# Altium project VYLTIOT0OSM-SF.PrjPcb
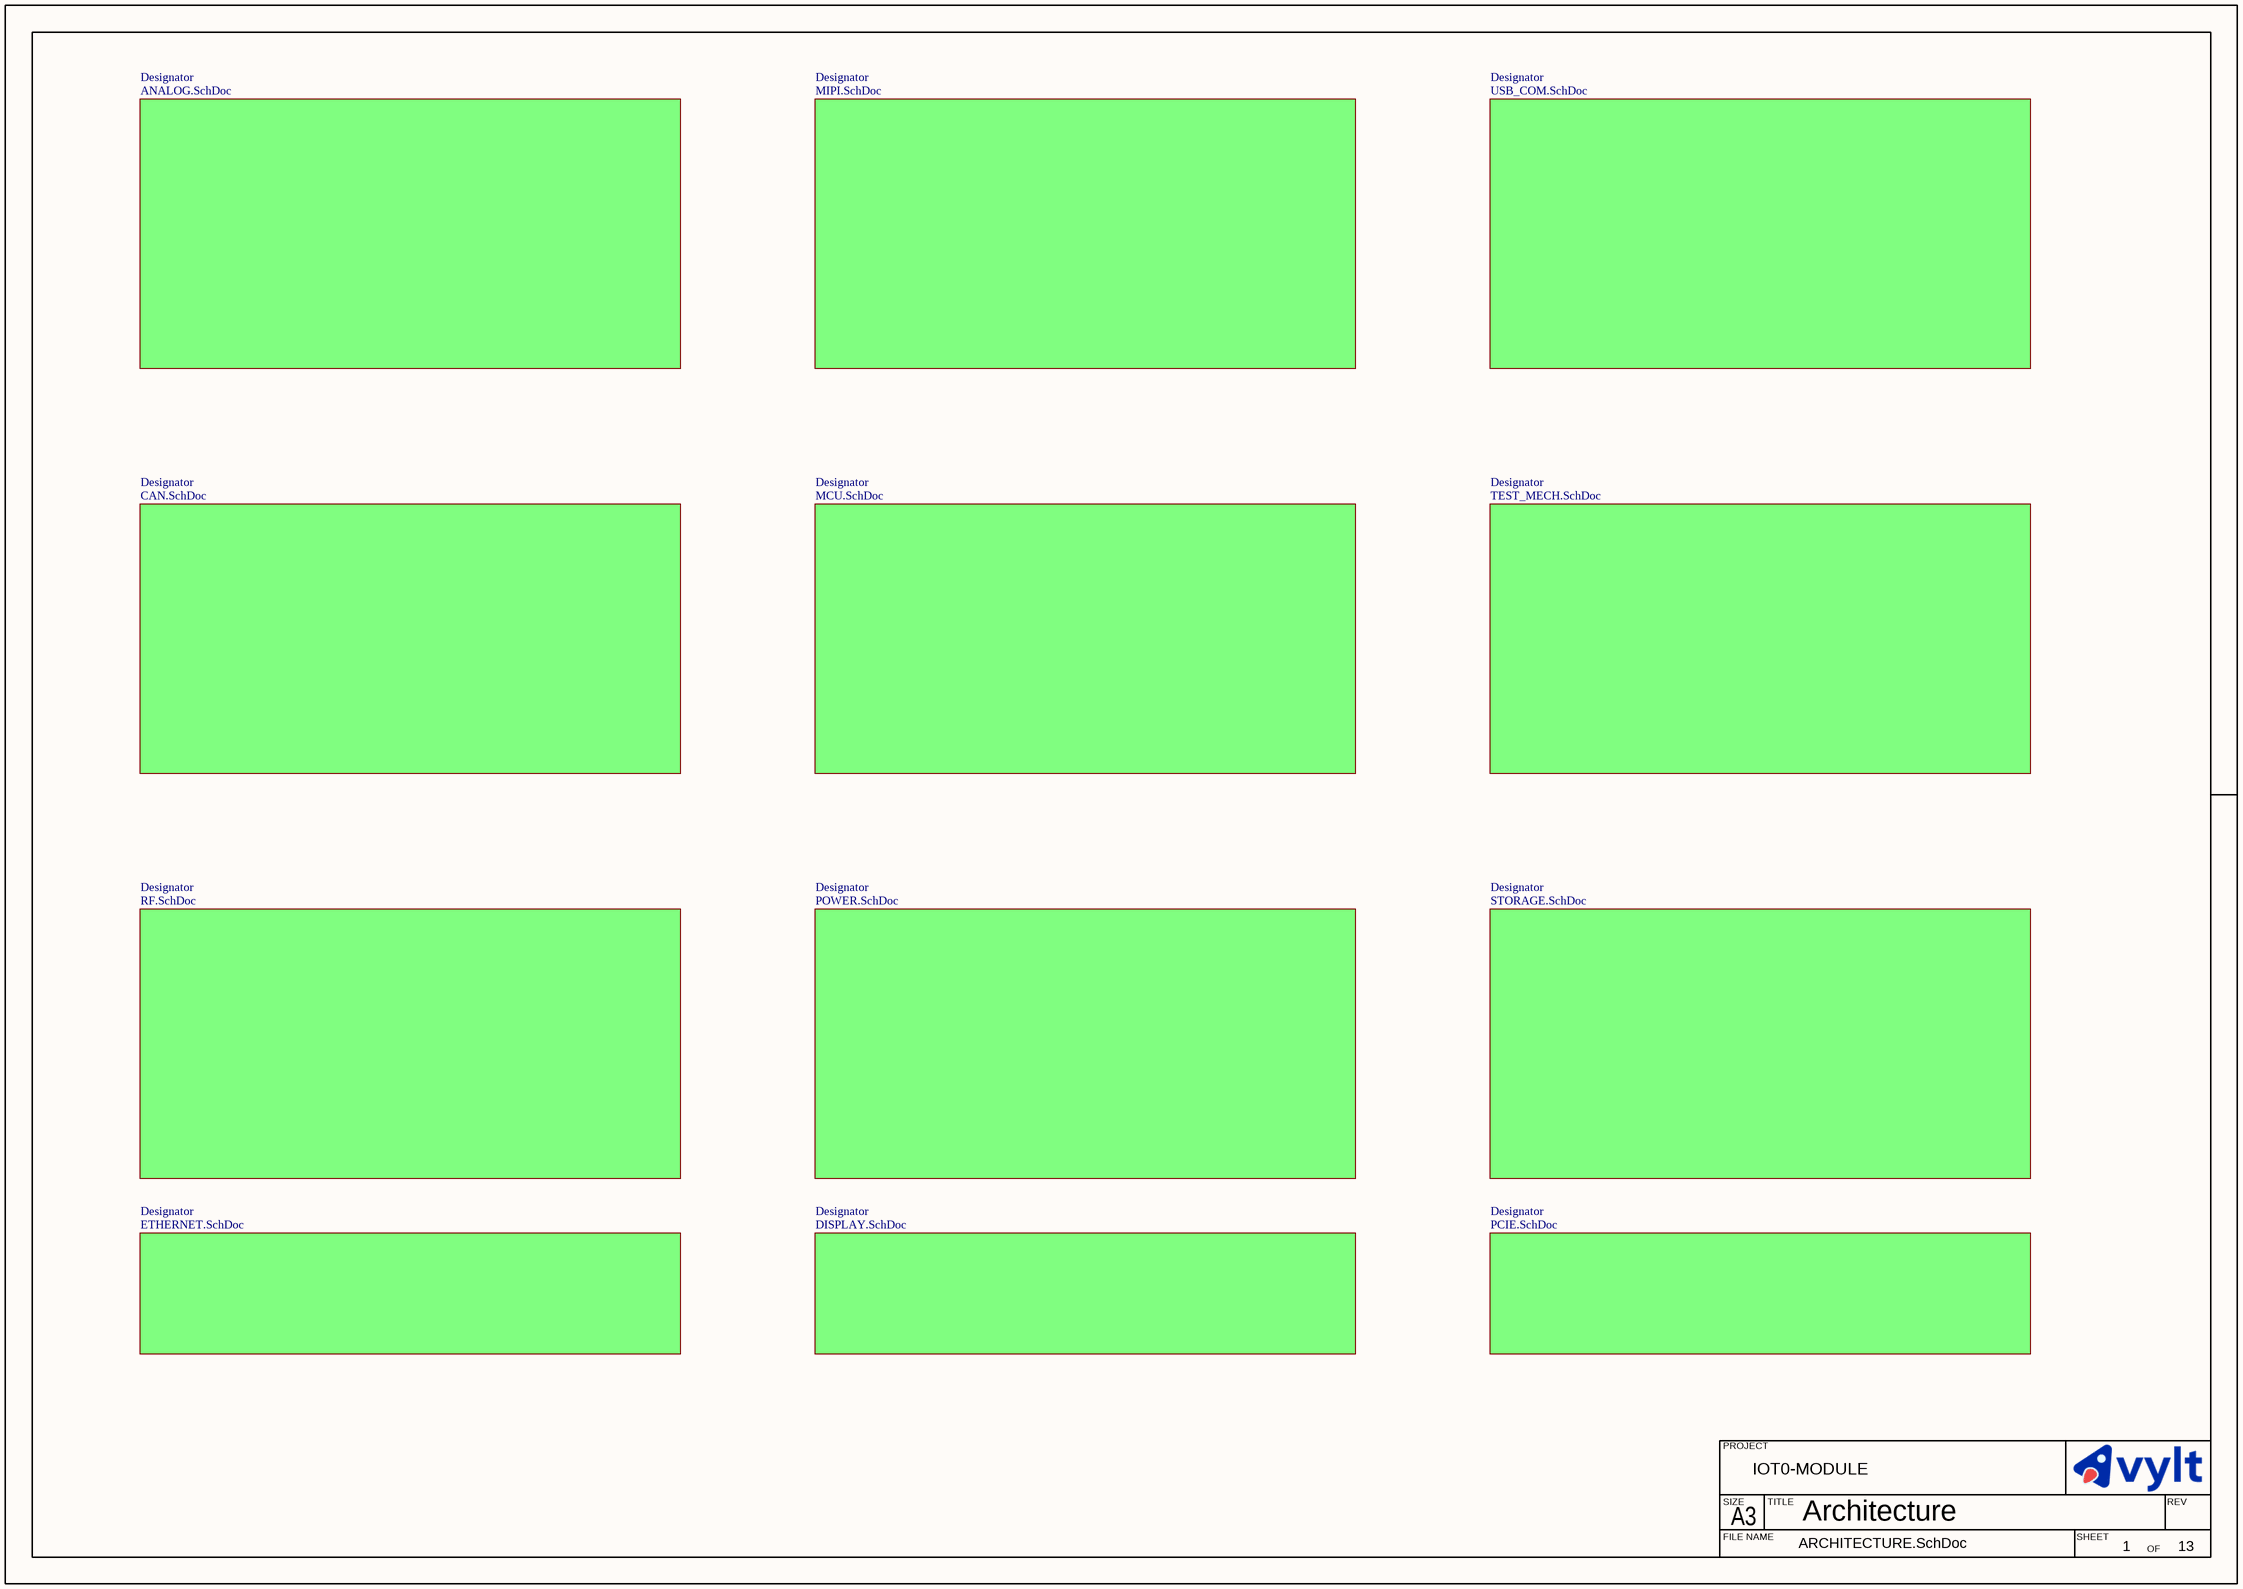
[diagram p0: ARCHITECTURE.SchDoc]
SheetTotal: 13; Rev: 1.0; Project: IOT0-MODULE
9 sheets, 360 parts. Net scope: global (net labels, ports and power ports of the same name join across sheets).
Board file: VYLTIOT0OSM-SF.PcbDoc
Sheets:
  ARCHITECTURE.SchDoc
    Designator = MCU.SchDoc
    Designator = TEST_MECH.SchDoc
    Designator = RF.SchDoc
    Designator = POWER.SchDoc
    Designator = MIPI.SchDoc
    Designator = ETHERNET.SchDoc
    Designator = DISPLAY.SchDoc
    Designator = PCIE.SchDoc

## Sheet ARCHITECTURE.SchDoc: Architecture
size 420 x 297 mm; Revision: 1.0; SheetNumber: 1

### Sub-sheets
Designator = MCU.SchDoc: no entries
Designator = USB_COM.SchDoc (file not in this document): no entries
Designator = TEST_MECH.SchDoc: no entries
Designator = STORAGE.SchDoc (file not in this document): no entries
Designator = ANALOG.SchDoc (file not in this document): no entries
Designator = CAN.SchDoc (file not in this document): no entries
Designator = RF.SchDoc: no entries
Designator = POWER.SchDoc: no entries
Designator = MIPI.SchDoc: no entries
Designator = ETHERNET.SchDoc: no entries
Designator = DISPLAY.SchDoc: no entries
Designator = PCIE.SchDoc: no entries

### Notes on the sheet
- PROJECT
- SIZE
- FILE NAME
- A3
- TITLE
- SHEET
- OF
- REV

## Sheet MCU.SchDoc: ESP32 SoC
size 420 x 297 mm; Revision: 1.0; SheetNumber: 9
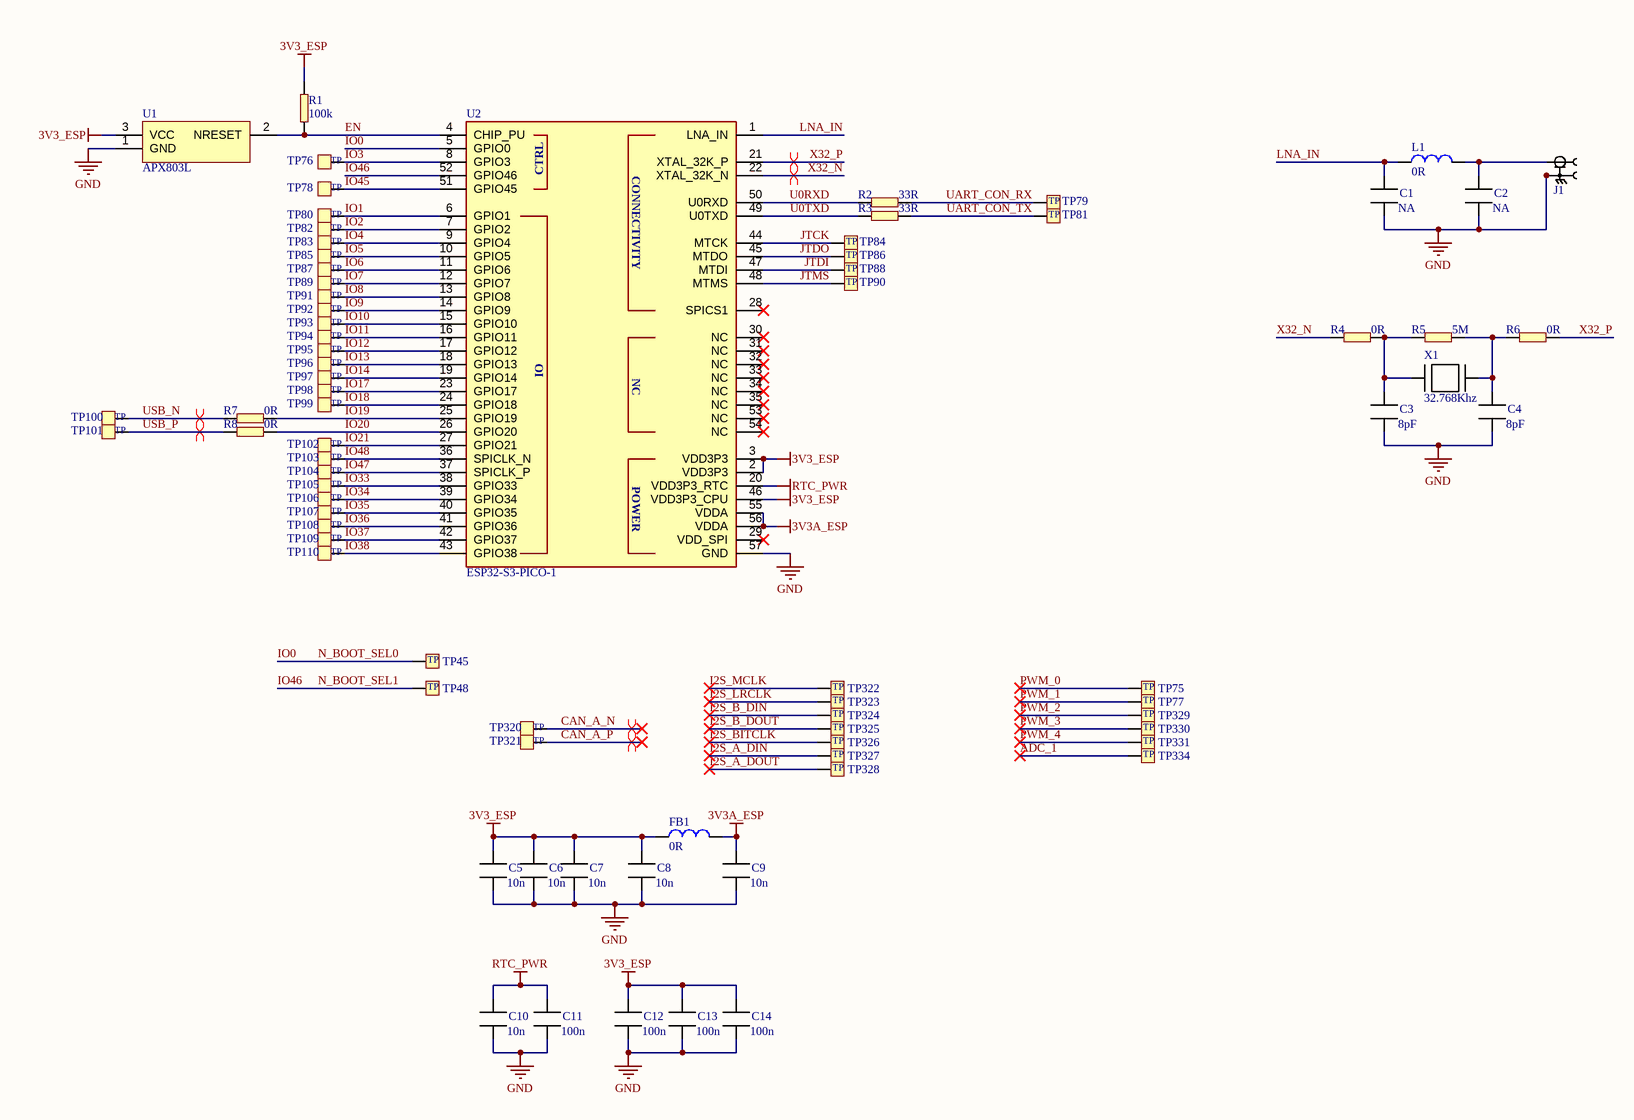
[diagram p1: MCU.SchDoc]

### Parts
C1  value NA  [CAPC0603X03L]  (hidden comment: ERP_102-1)  (no BOM)
C2  value NA  [CAPC0603X03L]  (hidden comment: ERP_102-1)  (no BOM)
C3  value 8pF  [CAPC0603X03L]  (hidden comment: ERP_102-1)  (no BOM)
C4  value 8pF  [CAPC0603X03L]  (hidden comment: ERP_102-1)  (no BOM)
C5  value 10n  [CAPC0603X03L]  (hidden comment: ERP_102-1)
C6  value 10n  [CAPC0603X03L]  (hidden comment: ERP_102-1)
C7  value 10n  [CAPC0603X03L]  (hidden comment: ERP_102-1)
C8  value 10n  [CAPC0603X03L]  (hidden comment: ERP_102-1)
C9  value 10n  [CAPC0603X03L]  (hidden comment: ERP_102-1)
C10  value 10n  [CAPC0603X03L]  (hidden comment: ERP_102-1)
C11  value 100n  [CAPC0603X03L]  (hidden comment: ERP_102-1)
C12  value 100n  [CAPC0603X03L]  (hidden comment: ERP_102-1)
C13  value 100n  [CAPC0603X03L]  (hidden comment: ERP_102-1)
C14  value 100n  [CAPC0603X03L]  (hidden comment: ERP_102-1)
FB1  value 0R  [INDC0603X03L]  (hidden comment: ERP_103-3)
J1  ERP_148-1  [uFL_50R]  (value not drawn)
L1  value 0R  [IND_0603]  (hidden comment: ERP_103-3)
R1  value 100k  [RESC0603X03L]  (hidden comment: ERP_101-1)
R2  value 33R  [RESC0603X03L]  (hidden comment: ERP_101-1)
R3  value 33R  [RESC0603X03L]  (hidden comment: ERP_101-1)
R4  value 0R  [RESC0603X03L]  (hidden comment: ERP_101-1)
R5  value 5M  [RESC0603X03L]  (hidden comment: ERP_101-1)  (no BOM)
R6  value 0R  [RESC0603X03L]  (hidden comment: ERP_101-1)
R7  value 0R  [RESC0603X03L]  (hidden comment: ERP_101-1)
R8  value 0R  [RESC0603X03L]  (hidden comment: ERP_101-1)
TP45  TP_0P8MM  [TP_0P8MM]  (value not drawn)  (no BOM)
TP48  TP_0P8MM  [TP_0P8MM]  (value not drawn)  (no BOM)
TP75  TP_0P8MM  [TP_0P8MM]  (value not drawn)  (no BOM)
TP76  TP_0P8MM  [TP_0P8MM]  (value not drawn)  (no BOM)
TP77  TP_0P8MM  [TP_0P8MM]  (value not drawn)  (no BOM)
TP78  TP_0P8MM  [TP_0P8MM]  (value not drawn)  (no BOM)
TP79  TP_0P8MM  [TP_0P8MM]  (value not drawn)  (no BOM)
TP80  TP_0P8MM  [TP_0P8MM]  (value not drawn)  (no BOM)
TP81  TP_0P8MM  [TP_0P8MM]  (value not drawn)  (no BOM)
TP82  TP_0P8MM  [TP_0P8MM]  (value not drawn)  (no BOM)
TP83  TP_0P8MM  [TP_0P8MM]  (value not drawn)  (no BOM)
TP84  TP_0P8MM  [TP_0P8MM]  (value not drawn)  (no BOM)
TP85  TP_0P8MM  [TP_0P8MM]  (value not drawn)  (no BOM)
TP86  TP_0P8MM  [TP_0P8MM]  (value not drawn)  (no BOM)
TP87  TP_0P8MM  [TP_0P8MM]  (value not drawn)  (no BOM)
TP88  TP_0P8MM  [TP_0P8MM]  (value not drawn)  (no BOM)
TP89  TP_0P8MM  [TP_0P8MM]  (value not drawn)  (no BOM)
TP90  TP_0P8MM  [TP_0P8MM]  (value not drawn)  (no BOM)
TP91  TP_0P8MM  [TP_0P8MM]  (value not drawn)  (no BOM)
TP92  TP_0P8MM  [TP_0P8MM]  (value not drawn)  (no BOM)
TP93  TP_0P8MM  [TP_0P8MM]  (value not drawn)  (no BOM)
TP94  TP_0P8MM  [TP_0P8MM]  (value not drawn)  (no BOM)
TP95  TP_0P8MM  [TP_0P8MM]  (value not drawn)  (no BOM)
TP96  TP_0P8MM  [TP_0P8MM]  (value not drawn)  (no BOM)
TP97  TP_0P8MM  [TP_0P8MM]  (value not drawn)  (no BOM)
TP98  TP_0P8MM  [TP_0P8MM]  (value not drawn)  (no BOM)
TP99  TP_0P8MM  [TP_0P8MM]  (value not drawn)  (no BOM)
TP100  TP_0P8MM  [TP_0P8MM]  (value not drawn)  (no BOM)
TP101  TP_0P8MM  [TP_0P8MM]  (value not drawn)  (no BOM)
TP102  TP_0P8MM  [TP_0P8MM]  (value not drawn)  (no BOM)
TP103  TP_0P8MM  [TP_0P8MM]  (value not drawn)  (no BOM)
TP104  TP_0P8MM  [TP_0P8MM]  (value not drawn)  (no BOM)
TP105  TP_0P8MM  [TP_0P8MM]  (value not drawn)  (no BOM)
TP106  TP_0P8MM  [TP_0P8MM]  (value not drawn)  (no BOM)
TP107  TP_0P8MM  [TP_0P8MM]  (value not drawn)  (no BOM)
TP108  TP_0P8MM  [TP_0P8MM]  (value not drawn)  (no BOM)
TP109  TP_0P8MM  [TP_0P8MM]  (value not drawn)  (no BOM)
TP110  TP_0P8MM  [TP_0P8MM]  (value not drawn)  (no BOM)
TP320  TP_0P8MM  [TP_0P8MM]  (value not drawn)  (no BOM)
TP321  TP_0P8MM  [TP_0P8MM]  (value not drawn)  (no BOM)
TP322  TP_0P8MM  [TP_0P8MM]  (value not drawn)  (no BOM)
TP323  TP_0P8MM  [TP_0P8MM]  (value not drawn)  (no BOM)
TP324  TP_0P8MM  [TP_0P8MM]  (value not drawn)  (no BOM)
TP325  TP_0P8MM  [TP_0P8MM]  (value not drawn)  (no BOM)
TP326  TP_0P8MM  [TP_0P8MM]  (value not drawn)  (no BOM)
TP327  TP_0P8MM  [TP_0P8MM]  (value not drawn)  (no BOM)
TP328  TP_0P8MM  [TP_0P8MM]  (value not drawn)  (no BOM)
TP329  TP_0P8MM  [TP_0P8MM]  (value not drawn)  (no BOM)
TP330  TP_0P8MM  [TP_0P8MM]  (value not drawn)  (no BOM)
TP331  TP_0P8MM  [TP_0P8MM]  (value not drawn)  (no BOM)
TP334  TP_0P8MM  [TP_0P8MM]  (value not drawn)  (no BOM)
U1  APX803L  [APX803L]
U2  value ESP32-S3-PICO-1  [QFN40P700X700X106_HS-57N]  (hidden comment: ERP_121-4)
X1  value 32.768Khz  [CRYS_L1.6_W1]  (hidden comment: ERP_111-1)

### Nets
3V3_ESP: C5.1 C6.1 C7.1 C8.1 C12.1 C13.1 C14.1 FB1.1 R1.2 U1.3(VCC) U2.2(VDD3P3) U2.3(VDD3P3) U2.46(VDD3P3_CPU)
3V3A_ESP: C9.1 FB1.2 U2.55(VDDA) U2.56(VDDA)
GND: C1.2 C2.2 C3.2 C4.2 C5.2 C6.2 C7.2 C8.2 C9.2 C10.2 C11.2 C12.2 C13.2 C14.2 J1.2 J1.3 U1.1(GND) U2.57(GND)
RTC_PWR: C10.1 C11.1 U2.20(VDD3P3_RTC)
ADC_1: TP334.1
CAN_A_N: TP320.1
CAN_A_P: TP321.1
EN: R1.1 U1.2(NRESET) U2.4(CHIP_PU)
I2S_A_DIN: TP327.1
I2S_A_DOUT: TP328.1
I2S_B_DIN: TP324.1
I2S_B_DOUT: TP325.1
I2S_BITCLK: TP326.1
I2S_LRCLK: TP323.1
I2S_MCLK: TP322.1
IO0: TP45.1 U2.5(GPIO0)  [also labelled N_BOOT_SEL0]
IO1: TP80.1 U2.6(GPIO1)
IO2: TP82.1 U2.7(GPIO2)
IO3: TP76.1 U2.8(GPIO3)
IO4: TP83.1 U2.9(GPIO4)
IO5: TP85.1 U2.10(GPIO5)
IO6: TP87.1 U2.11(GPIO6)
IO7: TP89.1 U2.12(GPIO7)
IO8: TP91.1 U2.13(GPIO8)
IO9: TP92.1 U2.14(GPIO9)
IO10: TP93.1 U2.15(GPIO10)
IO11: TP94.1 U2.16(GPIO11)
IO12: TP95.1 U2.17(GPIO12)
IO13: TP96.1 U2.18(GPIO13)
IO14: TP97.1 U2.19(GPIO14)
IO17: TP98.1 U2.23(GPIO17)
IO18: TP99.1 U2.24(GPIO18)
IO19: R7.1 U2.25(GPIO19)
IO20: R8.1 U2.26(GPIO20)
IO21: TP102.1 U2.27(GPIO21)
IO33: TP105.1 U2.38(GPIO33)
IO34: TP106.1 U2.39(GPIO34)
IO35: TP107.1 U2.40(GPIO35)
IO36: TP108.1 U2.41(GPIO36)
IO37: TP109.1 U2.42(GPIO37)
IO38: TP110.1 U2.43(GPIO38)
IO45: TP78.1 U2.51(GPIO45)
IO46: TP48.1 U2.52(GPIO46)  [also labelled N_BOOT_SEL1]
IO47: TP104.1 U2.37(SPICLK_P)
IO48: TP103.1 U2.36(SPICLK_N)
JTCK: TP84.1 U2.44(MTCK)
JTDI: TP88.1 U2.47(MTDI)
JTDO: TP86.1 U2.45(MTDO)
JTMS: TP90.1 U2.48(MTMS)
LNA_IN: C1.1 L1.1 U2.1(LNA_IN)
PWM_0: TP75.1
PWM_1: TP77.1
PWM_2: TP329.1
PWM_3: TP330.1
PWM_4: TP331.1
U0RXD: R2.2 U2.50(U0RXD)
U0TXD: R3.2 U2.49(U0TXD)
UART_CON_RX: R2.1 TP79.1
UART_CON_TX: R3.1 TP81.1
USB_N: R7.2 TP100.1
USB_P: R8.2 TP101.1
X32_N: R4.2 U2.22(XTAL_32K_N)
X32_P: R6.1 U2.21(XTAL_32K_P)
NetC2_1: C2.1 J1.1 L1.2
NetC3_1: C3.1 R4.1 R5.2 X1.1
NetC4_1: C4.1 R5.1 R6.2 X1.2

Not connected (* = marked no-connect by the designer): U2 28(SPICS1)* 29(VDD_SPI)* 30(NC)* 31(NC)* 32(NC)* 33(NC)* 34(NC)* 35(NC)* 53(NC)* 54(NC)*

### Layout directives
differential pair: CAN_A_N, CAN_A_P, USB_N, USB_P, X32_N, X32_P

### Notes on the sheet
- PROJECT
- SIZE
- FILE NAME
- A3
- TITLE
- SHEET
- OF
- REV
- (in symbol ESP32-S3-PICO-1) CTRL; CONNECTIVITY; IO; POWER
- (in symbol TP_0P8MM) TP

### Library data of the parts
C1-C14 = MLCC_0201: Chip Capacitor, 2-Leads, Body 0.60x0.30mm, IPC High Density; Package: 0201; Manufacturer 1: *; Manufacturer Part Number 1: *; ERP: *
FB1 = FB_0201: FERRITE BEAD 0201; ERP: *; Manufacturer Part Number 1: *; Manufacturer 1: *; Package: 0201
J1 = uFL_50R: Package: UMCC; Value: *; ERP: *; Manufacturer 1: *; Manufacturer Part Number 1: *; Supplier 1: *; Suuplier Part Number 1: *
L1 = IND_0603: ERP: *; Suuplier Part Number 1: *; Supplier 1: *; Manufacturer Part Number 1: *; Manufacturer 1: *; Package: 0603
R1-R8 = RES_0201: Package: 0201; Manufacturer 1: *; Manufacturer Part Number 1: *; ERP: *
TP45 TP48 TP75-TP110 TP320-TP331 TP334 = TP_0P8MM: OSM Footprint 0P8 LGA Ball
U1 = APX803L: IC SUPERVISOR 1 CHANNEL SOT23; Manufacturer Part Number 1: APX803L20-33SA-7; Manufacturer 1: Diodes Incorporated; Value: APX803L
U2 = ESP32-S3-PICO-1: RF TXRX MOD BLUETOOTH WIFISMD; Manufacturer 1: Espressif Systems; Package: 56-TFQFN; ERP: *
X1 = CRYS_L1.6_W1: CRYSTAL 1P6XW1P0; Manufacturer Part Number 1: ECS-.327-6-16R-TR; Manufacturer 1: ECS Inc.; Package: 1P6_1P0; ERP: *

## Sheet TEST_MECH.SchDoc
size 420 x 297 mm; SheetNumber: 3
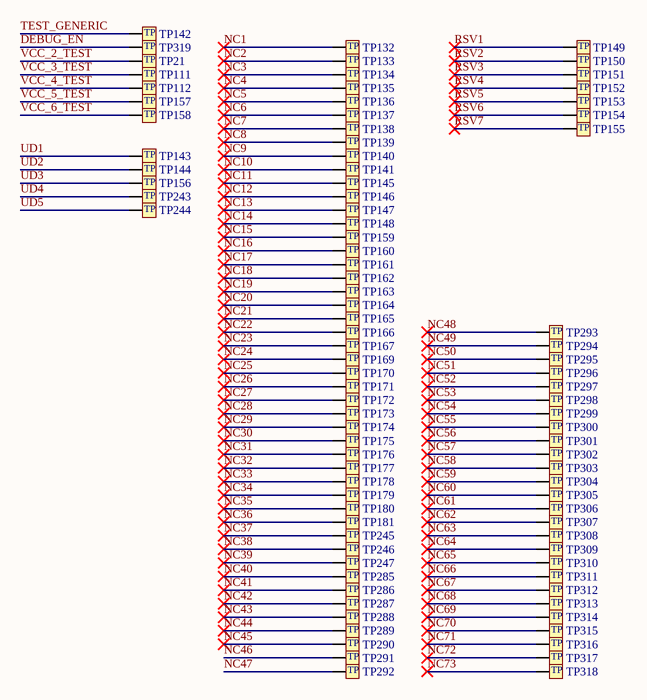
[diagram p2: TEST_MECH.SchDoc]

### Parts
TP21  TP_0P8MM  [TP_0P8MM]  (value not drawn)  (no BOM)
TP111  TP_0P8MM  [TP_0P8MM]  (value not drawn)  (no BOM)
TP112  TP_0P8MM  [TP_0P8MM]  (value not drawn)  (no BOM)
TP132  TP_0P8MM  [TP_0P8MM]  (value not drawn)  (no BOM)
TP133  TP_0P8MM  [TP_0P8MM]  (value not drawn)  (no BOM)
TP134  TP_0P8MM  [TP_0P8MM]  (value not drawn)  (no BOM)
TP135  TP_0P8MM  [TP_0P8MM]  (value not drawn)  (no BOM)
TP136  TP_0P8MM  [TP_0P8MM]  (value not drawn)  (no BOM)
TP137  TP_0P8MM  [TP_0P8MM]  (value not drawn)  (no BOM)
TP138  TP_0P8MM  [TP_0P8MM]  (value not drawn)  (no BOM)
TP139  TP_0P8MM  [TP_0P8MM]  (value not drawn)  (no BOM)
TP140  TP_0P8MM  [TP_0P8MM]  (value not drawn)  (no BOM)
TP141  TP_0P8MM  [TP_0P8MM]  (value not drawn)  (no BOM)
TP142  TP_0P8MM  [TP_0P8MM]  (value not drawn)  (no BOM)
TP143  TP_0P8MM  [TP_0P8MM]  (value not drawn)  (no BOM)
TP144  TP_0P8MM  [TP_0P8MM]  (value not drawn)  (no BOM)
TP145  TP_0P8MM  [TP_0P8MM]  (value not drawn)  (no BOM)
TP146  TP_0P8MM  [TP_0P8MM]  (value not drawn)  (no BOM)
TP147  TP_0P8MM  [TP_0P8MM]  (value not drawn)  (no BOM)
TP148  TP_0P8MM  [TP_0P8MM]  (value not drawn)  (no BOM)
TP149  TP_0P8MM  [TP_0P8MM]  (value not drawn)  (no BOM)
TP150  TP_0P8MM  [TP_0P8MM]  (value not drawn)  (no BOM)
TP151  TP_0P8MM  [TP_0P8MM]  (value not drawn)  (no BOM)
TP152  TP_0P8MM  [TP_0P8MM]  (value not drawn)  (no BOM)
TP153  TP_0P8MM  [TP_0P8MM]  (value not drawn)  (no BOM)
TP154  TP_0P8MM  [TP_0P8MM]  (value not drawn)  (no BOM)
TP155  TP_0P8MM  [TP_0P8MM]  (value not drawn)  (no BOM)
TP156  TP_0P8MM  [TP_0P8MM]  (value not drawn)  (no BOM)
TP157  TP_0P8MM  [TP_0P8MM]  (value not drawn)  (no BOM)
TP158  TP_0P8MM  [TP_0P8MM]  (value not drawn)  (no BOM)
TP159  TP_0P8MM  [TP_0P8MM]  (value not drawn)  (no BOM)
TP160  TP_0P8MM  [TP_0P8MM]  (value not drawn)  (no BOM)
TP161  TP_0P8MM  [TP_0P8MM]  (value not drawn)  (no BOM)
TP162  TP_0P8MM  [TP_0P8MM]  (value not drawn)  (no BOM)
TP163  TP_0P8MM  [TP_0P8MM]  (value not drawn)  (no BOM)
TP164  TP_0P8MM  [TP_0P8MM]  (value not drawn)  (no BOM)
TP165  TP_0P8MM  [TP_0P8MM]  (value not drawn)  (no BOM)
TP166  TP_0P8MM  [TP_0P8MM]  (value not drawn)  (no BOM)
TP167  TP_0P8MM  [TP_0P8MM]  (value not drawn)  (no BOM)
TP169  TP_0P8MM  [TP_0P8MM]  (value not drawn)  (no BOM)
TP170  TP_0P8MM  [TP_0P8MM]  (value not drawn)  (no BOM)
TP171  TP_0P8MM  [TP_0P8MM]  (value not drawn)  (no BOM)
TP172  TP_0P8MM  [TP_0P8MM]  (value not drawn)  (no BOM)
TP173  TP_0P8MM  [TP_0P8MM]  (value not drawn)  (no BOM)
TP174  TP_0P8MM  [TP_0P8MM]  (value not drawn)  (no BOM)
TP175  TP_0P8MM  [TP_0P8MM]  (value not drawn)  (no BOM)
TP176  TP_0P8MM  [TP_0P8MM]  (value not drawn)  (no BOM)
TP177  TP_0P8MM  [TP_0P8MM]  (value not drawn)  (no BOM)
TP178  TP_0P8MM  [TP_0P8MM]  (value not drawn)  (no BOM)
TP179  TP_0P8MM  [TP_0P8MM]  (value not drawn)  (no BOM)
TP180  TP_0P8MM  [TP_0P8MM]  (value not drawn)  (no BOM)
TP181  TP_0P8MM  [TP_0P8MM]  (value not drawn)  (no BOM)
TP243  TP_0P8MM  [TP_0P8MM]  (value not drawn)  (no BOM)
TP244  TP_0P8MM  [TP_0P8MM]  (value not drawn)  (no BOM)
TP245  TP_0P8MM  [TP_0P8MM]  (value not drawn)  (no BOM)
TP246  TP_0P8MM  [TP_0P8MM]  (value not drawn)  (no BOM)
TP247  TP_0P8MM  [TP_0P8MM]  (value not drawn)  (no BOM)
TP285  TP_0P8MM  [TP_0P8MM]  (value not drawn)  (no BOM)
TP286  TP_0P8MM  [TP_0P8MM]  (value not drawn)  (no BOM)
TP287  TP_0P8MM  [TP_0P8MM]  (value not drawn)  (no BOM)
TP288  TP_0P8MM  [TP_0P8MM]  (value not drawn)  (no BOM)
TP289  TP_0P8MM  [TP_0P8MM]  (value not drawn)  (no BOM)
TP290  TP_0P8MM  [TP_0P8MM]  (value not drawn)  (no BOM)
TP291  TP_0P8MM  [TP_0P8MM]  (value not drawn)  (no BOM)
TP292  TP_0P8MM  [TP_0P8MM]  (value not drawn)  (no BOM)
TP293  TP_0P8MM  [TP_0P8MM]  (value not drawn)  (no BOM)
TP294  TP_0P8MM  [TP_0P8MM]  (value not drawn)  (no BOM)
TP295  TP_0P8MM  [TP_0P8MM]  (value not drawn)  (no BOM)
TP296  TP_0P8MM  [TP_0P8MM]  (value not drawn)  (no BOM)
TP297  TP_0P8MM  [TP_0P8MM]  (value not drawn)  (no BOM)
TP298  TP_0P8MM  [TP_0P8MM]  (value not drawn)  (no BOM)
TP299  TP_0P8MM  [TP_0P8MM]  (value not drawn)  (no BOM)
TP300  TP_0P8MM  [TP_0P8MM]  (value not drawn)  (no BOM)
TP301  TP_0P8MM  [TP_0P8MM]  (value not drawn)  (no BOM)
TP302  TP_0P8MM  [TP_0P8MM]  (value not drawn)  (no BOM)
TP303  TP_0P8MM  [TP_0P8MM]  (value not drawn)  (no BOM)
TP304  TP_0P8MM  [TP_0P8MM]  (value not drawn)  (no BOM)
TP305  TP_0P8MM  [TP_0P8MM]  (value not drawn)  (no BOM)
TP306  TP_0P8MM  [TP_0P8MM]  (value not drawn)  (no BOM)
TP307  TP_0P8MM  [TP_0P8MM]  (value not drawn)  (no BOM)
TP308  TP_0P8MM  [TP_0P8MM]  (value not drawn)  (no BOM)
TP309  TP_0P8MM  [TP_0P8MM]  (value not drawn)  (no BOM)
TP310  TP_0P8MM  [TP_0P8MM]  (value not drawn)  (no BOM)
TP311  TP_0P8MM  [TP_0P8MM]  (value not drawn)  (no BOM)
TP312  TP_0P8MM  [TP_0P8MM]  (value not drawn)  (no BOM)
TP313  TP_0P8MM  [TP_0P8MM]  (value not drawn)  (no BOM)
TP314  TP_0P8MM  [TP_0P8MM]  (value not drawn)  (no BOM)
TP315  TP_0P8MM  [TP_0P8MM]  (value not drawn)  (no BOM)
TP316  TP_0P8MM  [TP_0P8MM]  (value not drawn)  (no BOM)
TP317  TP_0P8MM  [TP_0P8MM]  (value not drawn)  (no BOM)
TP318  TP_0P8MM  [TP_0P8MM]  (value not drawn)  (no BOM)
TP319  TP_0P8MM  [TP_0P8MM]  (value not drawn)  (no BOM)

### Nets
DEBUG_EN: TP319.1
NC1: TP132.1
NC2: TP133.1
NC3: TP134.1
NC4: TP135.1
NC5: TP136.1
NC6: TP137.1
NC7: TP138.1
NC8: TP139.1
NC9: TP140.1
NC10: TP141.1
NC11: TP145.1
NC12: TP146.1
NC13: TP147.1
NC14: TP148.1
NC15: TP159.1
NC16: TP160.1
NC17: TP161.1
NC18: TP162.1
NC19: TP163.1
NC20: TP164.1
NC21: TP165.1
NC22: TP166.1
NC23: TP167.1
NC24: TP169.1
NC25: TP170.1
NC26: TP171.1
NC27: TP172.1
NC28: TP173.1
NC29: TP174.1
NC30: TP175.1
NC31: TP176.1
NC32: TP177.1
NC33: TP178.1
NC34: TP179.1
NC35: TP180.1
NC36: TP181.1
NC37: TP245.1
NC38: TP246.1
NC39: TP247.1
NC40: TP285.1
NC41: TP286.1
NC42: TP287.1
NC43: TP288.1
NC44: TP289.1
NC45: TP290.1
NC46: TP291.1
NC47: TP292.1
NC48: TP293.1
NC49: TP294.1
NC50: TP295.1
NC51: TP296.1
NC52: TP297.1
NC53: TP298.1
NC54: TP299.1
NC55: TP300.1
NC56: TP301.1
NC57: TP302.1
NC58: TP303.1
NC59: TP304.1
NC60: TP305.1
NC61: TP306.1
NC62: TP307.1
NC63: TP308.1
NC64: TP309.1
NC65: TP310.1
NC66: TP311.1
NC67: TP312.1
NC68: TP313.1
NC69: TP314.1
NC70: TP315.1
NC71: TP316.1
NC72: TP317.1
NC73: TP318.1
RSV1: TP149.1
RSV2: TP150.1
RSV3: TP151.1
RSV4: TP152.1
RSV5: TP153.1
RSV6: TP154.1
RSV7: TP155.1
TEST_GENERIC: TP142.1
UD1: TP143.1
UD2: TP144.1
UD3: TP156.1
UD4: TP243.1
UD5: TP244.1
VCC_2_TEST: TP21.1
VCC_3_TEST: TP111.1
VCC_4_TEST: TP112.1
VCC_5_TEST: TP157.1
VCC_6_TEST: TP158.1

### Notes on the sheet
- PROJECT
- SIZE
- FILE NAME
- A3
- TITLE
- SHEET
- OF
- REV
- (in symbol TP_0P8MM) TP

### Library data of the parts
TP21 TP111 TP112 TP132-TP167 TP169-TP181 TP243-TP247 TP285-TP319 = TP_0P8MM: OSM Footprint 0P8 LGA Ball

## Sheet RF.SchDoc: RF
size 420 x 297 mm; Revision: 1.0; SheetNumber: 4
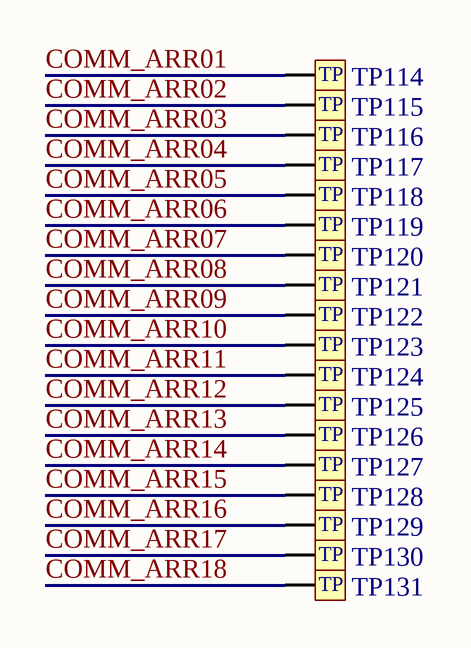
[diagram p3: RF.SchDoc]

### Parts
TP114  TP_0P8MM  [TP_0P8MM]  (value not drawn)  (no BOM)
TP115  TP_0P8MM  [TP_0P8MM]  (value not drawn)  (no BOM)
TP116  TP_0P8MM  [TP_0P8MM]  (value not drawn)  (no BOM)
TP117  TP_0P8MM  [TP_0P8MM]  (value not drawn)  (no BOM)
TP118  TP_0P8MM  [TP_0P8MM]  (value not drawn)  (no BOM)
TP119  TP_0P8MM  [TP_0P8MM]  (value not drawn)  (no BOM)
TP120  TP_0P8MM  [TP_0P8MM]  (value not drawn)  (no BOM)
TP121  TP_0P8MM  [TP_0P8MM]  (value not drawn)  (no BOM)
TP122  TP_0P8MM  [TP_0P8MM]  (value not drawn)  (no BOM)
TP123  TP_0P8MM  [TP_0P8MM]  (value not drawn)  (no BOM)
TP124  TP_0P8MM  [TP_0P8MM]  (value not drawn)  (no BOM)
TP125  TP_0P8MM  [TP_0P8MM]  (value not drawn)  (no BOM)
TP126  TP_0P8MM  [TP_0P8MM]  (value not drawn)  (no BOM)
TP127  TP_0P8MM  [TP_0P8MM]  (value not drawn)  (no BOM)
TP128  TP_0P8MM  [TP_0P8MM]  (value not drawn)  (no BOM)
TP129  TP_0P8MM  [TP_0P8MM]  (value not drawn)  (no BOM)
TP130  TP_0P8MM  [TP_0P8MM]  (value not drawn)  (no BOM)
TP131  TP_0P8MM  [TP_0P8MM]  (value not drawn)  (no BOM)

### Nets
COMM_ARR01: TP114.1
COMM_ARR02: TP115.1
COMM_ARR03: TP116.1
COMM_ARR04: TP117.1
COMM_ARR05: TP118.1
COMM_ARR06: TP119.1
COMM_ARR07: TP120.1
COMM_ARR08: TP121.1
COMM_ARR09: TP122.1
COMM_ARR10: TP123.1
COMM_ARR11: TP124.1
COMM_ARR12: TP125.1
COMM_ARR13: TP126.1
COMM_ARR14: TP127.1
COMM_ARR15: TP128.1
COMM_ARR16: TP129.1
COMM_ARR17: TP130.1
COMM_ARR18: TP131.1

### Notes on the sheet
- PROJECT
- SIZE
- FILE NAME
- A3
- TITLE
- SHEET
- OF
- REV
- (in symbol TP_0P8MM) TP

### Library data of the parts
TP114-TP131 = TP_0P8MM: OSM Footprint 0P8 LGA Ball

## Sheet POWER.SchDoc: Power Supply
size 420 x 297 mm; Revision: 1.0; SheetNumber: 2; SheetTotal: 10
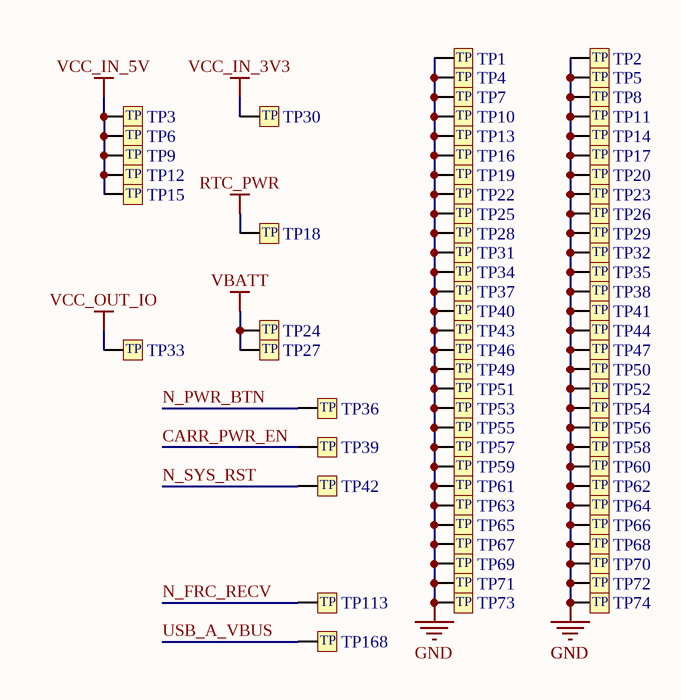
[diagram p4: POWER.SchDoc]

### Parts
TP1  TP_0P8MM  [TP_0P8MM]  (value not drawn)  (no BOM)
TP2  TP_0P8MM  [TP_0P8MM]  (value not drawn)  (no BOM)
TP3  TP_0P8MM  [TP_0P8MM]  (value not drawn)  (no BOM)
TP4  TP_0P8MM  [TP_0P8MM]  (value not drawn)  (no BOM)
TP5  TP_0P8MM  [TP_0P8MM]  (value not drawn)  (no BOM)
TP6  TP_0P8MM  [TP_0P8MM]  (value not drawn)  (no BOM)
TP7  TP_0P8MM  [TP_0P8MM]  (value not drawn)  (no BOM)
TP8  TP_0P8MM  [TP_0P8MM]  (value not drawn)  (no BOM)
TP9  TP_0P8MM  [TP_0P8MM]  (value not drawn)  (no BOM)
TP10  TP_0P8MM  [TP_0P8MM]  (value not drawn)  (no BOM)
TP11  TP_0P8MM  [TP_0P8MM]  (value not drawn)  (no BOM)
TP12  TP_0P8MM  [TP_0P8MM]  (value not drawn)  (no BOM)
TP13  TP_0P8MM  [TP_0P8MM]  (value not drawn)  (no BOM)
TP14  TP_0P8MM  [TP_0P8MM]  (value not drawn)  (no BOM)
TP15  TP_0P8MM  [TP_0P8MM]  (value not drawn)  (no BOM)
TP16  TP_0P8MM  [TP_0P8MM]  (value not drawn)  (no BOM)
TP17  TP_0P8MM  [TP_0P8MM]  (value not drawn)  (no BOM)
TP18  TP_0P8MM  [TP_0P8MM]  (value not drawn)  (no BOM)
TP19  TP_0P8MM  [TP_0P8MM]  (value not drawn)  (no BOM)
TP20  TP_0P8MM  [TP_0P8MM]  (value not drawn)  (no BOM)
TP22  TP_0P8MM  [TP_0P8MM]  (value not drawn)  (no BOM)
TP23  TP_0P8MM  [TP_0P8MM]  (value not drawn)  (no BOM)
TP24  TP_0P8MM  [TP_0P8MM]  (value not drawn)  (no BOM)
TP25  TP_0P8MM  [TP_0P8MM]  (value not drawn)  (no BOM)
TP26  TP_0P8MM  [TP_0P8MM]  (value not drawn)  (no BOM)
TP27  TP_0P8MM  [TP_0P8MM]  (value not drawn)  (no BOM)
TP28  TP_0P8MM  [TP_0P8MM]  (value not drawn)  (no BOM)
TP29  TP_0P8MM  [TP_0P8MM]  (value not drawn)  (no BOM)
TP30  TP_0P8MM  [TP_0P8MM]  (value not drawn)  (no BOM)
TP31  TP_0P8MM  [TP_0P8MM]  (value not drawn)  (no BOM)
TP32  TP_0P8MM  [TP_0P8MM]  (value not drawn)  (no BOM)
TP33  TP_0P8MM  [TP_0P8MM]  (value not drawn)  (no BOM)
TP34  TP_0P8MM  [TP_0P8MM]  (value not drawn)  (no BOM)
TP35  TP_0P8MM  [TP_0P8MM]  (value not drawn)  (no BOM)
TP36  TP_0P8MM  [TP_0P8MM]  (value not drawn)  (no BOM)
TP37  TP_0P8MM  [TP_0P8MM]  (value not drawn)  (no BOM)
TP38  TP_0P8MM  [TP_0P8MM]  (value not drawn)  (no BOM)
TP39  TP_0P8MM  [TP_0P8MM]  (value not drawn)  (no BOM)
TP40  TP_0P8MM  [TP_0P8MM]  (value not drawn)  (no BOM)
TP41  TP_0P8MM  [TP_0P8MM]  (value not drawn)  (no BOM)
TP42  TP_0P8MM  [TP_0P8MM]  (value not drawn)  (no BOM)
TP43  TP_0P8MM  [TP_0P8MM]  (value not drawn)  (no BOM)
TP44  TP_0P8MM  [TP_0P8MM]  (value not drawn)  (no BOM)
TP46  TP_0P8MM  [TP_0P8MM]  (value not drawn)  (no BOM)
TP47  TP_0P8MM  [TP_0P8MM]  (value not drawn)  (no BOM)
TP49  TP_0P8MM  [TP_0P8MM]  (value not drawn)  (no BOM)
TP50  TP_0P8MM  [TP_0P8MM]  (value not drawn)  (no BOM)
TP51  TP_0P8MM  [TP_0P8MM]  (value not drawn)  (no BOM)
TP52  TP_0P8MM  [TP_0P8MM]  (value not drawn)  (no BOM)
TP53  TP_0P8MM  [TP_0P8MM]  (value not drawn)  (no BOM)
TP54  TP_0P8MM  [TP_0P8MM]  (value not drawn)  (no BOM)
TP55  TP_0P8MM  [TP_0P8MM]  (value not drawn)  (no BOM)
TP56  TP_0P8MM  [TP_0P8MM]  (value not drawn)  (no BOM)
TP57  TP_0P8MM  [TP_0P8MM]  (value not drawn)  (no BOM)
TP58  TP_0P8MM  [TP_0P8MM]  (value not drawn)  (no BOM)
TP59  TP_0P8MM  [TP_0P8MM]  (value not drawn)  (no BOM)
TP60  TP_0P8MM  [TP_0P8MM]  (value not drawn)  (no BOM)
TP61  TP_0P8MM  [TP_0P8MM]  (value not drawn)  (no BOM)
TP62  TP_0P8MM  [TP_0P8MM]  (value not drawn)  (no BOM)
TP63  TP_0P8MM  [TP_0P8MM]  (value not drawn)  (no BOM)
TP64  TP_0P8MM  [TP_0P8MM]  (value not drawn)  (no BOM)
TP65  TP_0P8MM  [TP_0P8MM]  (value not drawn)  (no BOM)
TP66  TP_0P8MM  [TP_0P8MM]  (value not drawn)  (no BOM)
TP67  TP_0P8MM  [TP_0P8MM]  (value not drawn)  (no BOM)
TP68  TP_0P8MM  [TP_0P8MM]  (value not drawn)  (no BOM)
TP69  TP_0P8MM  [TP_0P8MM]  (value not drawn)  (no BOM)
TP70  TP_0P8MM  [TP_0P8MM]  (value not drawn)  (no BOM)
TP71  TP_0P8MM  [TP_0P8MM]  (value not drawn)  (no BOM)
TP72  TP_0P8MM  [TP_0P8MM]  (value not drawn)  (no BOM)
TP73  TP_0P8MM  [TP_0P8MM]  (value not drawn)  (no BOM)
TP74  TP_0P8MM  [TP_0P8MM]  (value not drawn)  (no BOM)
TP113  TP_0P8MM  [TP_0P8MM]  (value not drawn)  (no BOM)
TP168  TP_0P8MM  [TP_0P8MM]  (value not drawn)  (no BOM)

### Nets
GND: TP1.1 TP2.1 TP4.1 TP5.1 TP7.1 TP8.1 TP10.1 TP11.1 TP13.1 TP14.1 TP16.1 TP17.1 TP19.1 TP20.1 TP22.1 TP23.1 TP25.1 TP26.1 TP28.1 TP29.1 TP31.1 TP32.1 TP34.1 TP35.1 TP37.1 TP38.1 TP40.1 TP41.1 TP43.1 TP44.1 TP46.1 TP47.1 TP49.1 TP50.1 TP51.1 TP52.1 TP53.1 TP54.1 TP55.1 TP56.1 TP57.1 TP58.1 TP59.1 TP60.1 TP61.1 TP62.1 TP63.1 TP64.1 TP65.1 TP66.1 TP67.1 TP68.1 TP69.1 TP70.1 TP71.1 TP72.1 TP73.1 TP74.1
RTC_PWR: TP18.1
VBATT: TP24.1 TP27.1
VCC_IN_3V3: TP30.1
VCC_IN_5V: TP3.1 TP6.1 TP9.1 TP12.1 TP15.1
VCC_OUT_IO: TP33.1
CARR_PWR_EN: TP39.1
N_FRC_RECV: TP113.1
N_PWR_BTN: TP36.1
N_SYS_RST: TP42.1
USB_A_VBUS: TP168.1

### Notes on the sheet
- PROJECT
- SIZE
- FILE NAME
- A3
- TITLE
- SHEET
- OF
- REV
- (in symbol TP_0P8MM) TP

### Library data of the parts
TP1-TP20 TP22-TP44 TP46 TP47 TP49-TP74 TP113 TP168 = TP_0P8MM: OSM Footprint 0P8 LGA Ball

## Sheet MIPI.SchDoc: MIPI
size 420 x 297 mm; Revision: 1.0; SheetNumber: 10
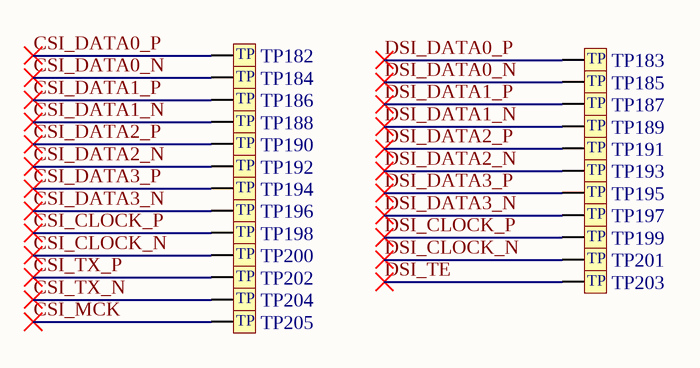
[diagram p5: MIPI.SchDoc]

### Parts
TP182  TP_0P8MM  [TP_0P8MM]  (value not drawn)  (no BOM)
TP183  TP_0P8MM  [TP_0P8MM]  (value not drawn)  (no BOM)
TP184  TP_0P8MM  [TP_0P8MM]  (value not drawn)  (no BOM)
TP185  TP_0P8MM  [TP_0P8MM]  (value not drawn)  (no BOM)
TP186  TP_0P8MM  [TP_0P8MM]  (value not drawn)  (no BOM)
TP187  TP_0P8MM  [TP_0P8MM]  (value not drawn)  (no BOM)
TP188  TP_0P8MM  [TP_0P8MM]  (value not drawn)  (no BOM)
TP189  TP_0P8MM  [TP_0P8MM]  (value not drawn)  (no BOM)
TP190  TP_0P8MM  [TP_0P8MM]  (value not drawn)  (no BOM)
TP191  TP_0P8MM  [TP_0P8MM]  (value not drawn)  (no BOM)
TP192  TP_0P8MM  [TP_0P8MM]  (value not drawn)  (no BOM)
TP193  TP_0P8MM  [TP_0P8MM]  (value not drawn)  (no BOM)
TP194  TP_0P8MM  [TP_0P8MM]  (value not drawn)  (no BOM)
TP195  TP_0P8MM  [TP_0P8MM]  (value not drawn)  (no BOM)
TP196  TP_0P8MM  [TP_0P8MM]  (value not drawn)  (no BOM)
TP197  TP_0P8MM  [TP_0P8MM]  (value not drawn)  (no BOM)
TP198  TP_0P8MM  [TP_0P8MM]  (value not drawn)  (no BOM)
TP199  TP_0P8MM  [TP_0P8MM]  (value not drawn)  (no BOM)
TP200  TP_0P8MM  [TP_0P8MM]  (value not drawn)  (no BOM)
TP201  TP_0P8MM  [TP_0P8MM]  (value not drawn)  (no BOM)
TP202  TP_0P8MM  [TP_0P8MM]  (value not drawn)  (no BOM)
TP203  TP_0P8MM  [TP_0P8MM]  (value not drawn)  (no BOM)
TP204  TP_0P8MM  [TP_0P8MM]  (value not drawn)  (no BOM)
TP205  TP_0P8MM  [TP_0P8MM]  (value not drawn)  (no BOM)

### Nets
CSI_CLOCK_N: TP200.1
CSI_CLOCK_P: TP198.1
CSI_DATA0_N: TP184.1
CSI_DATA0_P: TP182.1
CSI_DATA1_N: TP188.1
CSI_DATA1_P: TP186.1
CSI_DATA2_N: TP192.1
CSI_DATA2_P: TP190.1
CSI_DATA3_N: TP196.1
CSI_DATA3_P: TP194.1
CSI_MCK: TP205.1
CSI_TX_N: TP204.1
CSI_TX_P: TP202.1
DSI_CLOCK_N: TP201.1
DSI_CLOCK_P: TP199.1
DSI_DATA0_N: TP185.1
DSI_DATA0_P: TP183.1
DSI_DATA1_N: TP189.1
DSI_DATA1_P: TP187.1
DSI_DATA2_N: TP193.1
DSI_DATA2_P: TP191.1
DSI_DATA3_N: TP197.1
DSI_DATA3_P: TP195.1
DSI_TE: TP203.1

### Notes on the sheet
- PROJECT
- SIZE
- FILE NAME
- A3
- TITLE
- SHEET
- OF
- REV
- (in symbol TP_0P8MM) TP

### Library data of the parts
TP182-TP205 = TP_0P8MM: OSM Footprint 0P8 LGA Ball

## Sheet ETHERNET.SchDoc: Ethernet
size 420 x 297 mm; Revision: 1.0; SheetNumber: 11
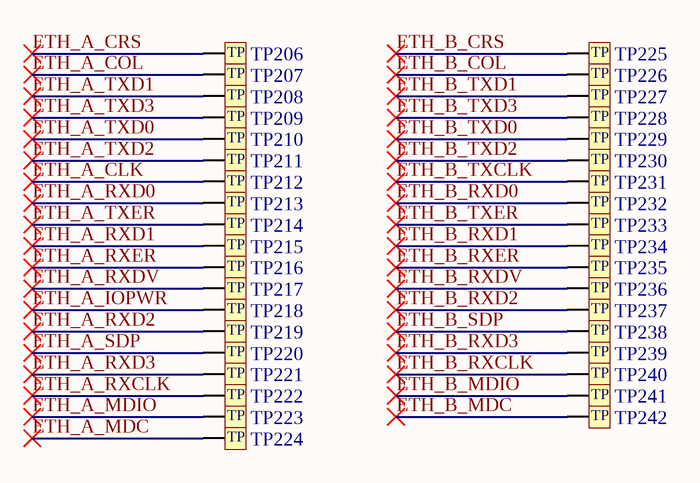
[diagram p6: ETHERNET.SchDoc]

### Parts
TP206  TP_0P8MM  [TP_0P8MM]  (value not drawn)  (no BOM)
TP207  TP_0P8MM  [TP_0P8MM]  (value not drawn)  (no BOM)
TP208  TP_0P8MM  [TP_0P8MM]  (value not drawn)  (no BOM)
TP209  TP_0P8MM  [TP_0P8MM]  (value not drawn)  (no BOM)
TP210  TP_0P8MM  [TP_0P8MM]  (value not drawn)  (no BOM)
TP211  TP_0P8MM  [TP_0P8MM]  (value not drawn)  (no BOM)
TP212  TP_0P8MM  [TP_0P8MM]  (value not drawn)  (no BOM)
TP213  TP_0P8MM  [TP_0P8MM]  (value not drawn)  (no BOM)
TP214  TP_0P8MM  [TP_0P8MM]  (value not drawn)  (no BOM)
TP215  TP_0P8MM  [TP_0P8MM]  (value not drawn)  (no BOM)
TP216  TP_0P8MM  [TP_0P8MM]  (value not drawn)  (no BOM)
TP217  TP_0P8MM  [TP_0P8MM]  (value not drawn)  (no BOM)
TP218  TP_0P8MM  [TP_0P8MM]  (value not drawn)  (no BOM)
TP219  TP_0P8MM  [TP_0P8MM]  (value not drawn)  (no BOM)
TP220  TP_0P8MM  [TP_0P8MM]  (value not drawn)  (no BOM)
TP221  TP_0P8MM  [TP_0P8MM]  (value not drawn)  (no BOM)
TP222  TP_0P8MM  [TP_0P8MM]  (value not drawn)  (no BOM)
TP223  TP_0P8MM  [TP_0P8MM]  (value not drawn)  (no BOM)
TP224  TP_0P8MM  [TP_0P8MM]  (value not drawn)  (no BOM)
TP225  TP_0P8MM  [TP_0P8MM]  (value not drawn)  (no BOM)
TP226  TP_0P8MM  [TP_0P8MM]  (value not drawn)  (no BOM)
TP227  TP_0P8MM  [TP_0P8MM]  (value not drawn)  (no BOM)
TP228  TP_0P8MM  [TP_0P8MM]  (value not drawn)  (no BOM)
TP229  TP_0P8MM  [TP_0P8MM]  (value not drawn)  (no BOM)
TP230  TP_0P8MM  [TP_0P8MM]  (value not drawn)  (no BOM)
TP231  TP_0P8MM  [TP_0P8MM]  (value not drawn)  (no BOM)
TP232  TP_0P8MM  [TP_0P8MM]  (value not drawn)  (no BOM)
TP233  TP_0P8MM  [TP_0P8MM]  (value not drawn)  (no BOM)
TP234  TP_0P8MM  [TP_0P8MM]  (value not drawn)  (no BOM)
TP235  TP_0P8MM  [TP_0P8MM]  (value not drawn)  (no BOM)
TP236  TP_0P8MM  [TP_0P8MM]  (value not drawn)  (no BOM)
TP237  TP_0P8MM  [TP_0P8MM]  (value not drawn)  (no BOM)
TP238  TP_0P8MM  [TP_0P8MM]  (value not drawn)  (no BOM)
TP239  TP_0P8MM  [TP_0P8MM]  (value not drawn)  (no BOM)
TP240  TP_0P8MM  [TP_0P8MM]  (value not drawn)  (no BOM)
TP241  TP_0P8MM  [TP_0P8MM]  (value not drawn)  (no BOM)
TP242  TP_0P8MM  [TP_0P8MM]  (value not drawn)  (no BOM)

### Nets
ETH_A_CLK: TP212.1
ETH_A_COL: TP207.1
ETH_A_CRS: TP206.1
ETH_A_IOPWR: TP218.1
ETH_A_MDC: TP224.1
ETH_A_MDIO: TP223.1
ETH_A_RXCLK: TP222.1
ETH_A_RXD0: TP213.1
ETH_A_RXD1: TP215.1
ETH_A_RXD2: TP219.1
ETH_A_RXD3: TP221.1
ETH_A_RXDV: TP217.1
ETH_A_RXER: TP216.1
ETH_A_SDP: TP220.1
ETH_A_TXD0: TP210.1
ETH_A_TXD1: TP208.1
ETH_A_TXD2: TP211.1
ETH_A_TXD3: TP209.1
ETH_A_TXER: TP214.1
ETH_B_COL: TP226.1
ETH_B_CRS: TP225.1
ETH_B_MDC: TP242.1
ETH_B_MDIO: TP241.1
ETH_B_RXCLK: TP240.1
ETH_B_RXD0: TP232.1
ETH_B_RXD1: TP234.1
ETH_B_RXD2: TP237.1
ETH_B_RXD3: TP239.1
ETH_B_RXDV: TP236.1
ETH_B_RXER: TP235.1
ETH_B_SDP: TP238.1
ETH_B_TXCLK: TP231.1
ETH_B_TXD0: TP229.1
ETH_B_TXD1: TP227.1
ETH_B_TXD2: TP230.1
ETH_B_TXD3: TP228.1
ETH_B_TXER: TP233.1

### Notes on the sheet
- PROJECT
- SIZE
- FILE NAME
- A3
- TITLE
- SHEET
- OF
- REV
- (in symbol TP_0P8MM) TP

### Library data of the parts
TP206-TP242 = TP_0P8MM: OSM Footprint 0P8 LGA Ball

## Sheet DISPLAY.SchDoc: Parallel Display
size 420 x 297 mm; Revision: 1.0; SheetNumber: 13
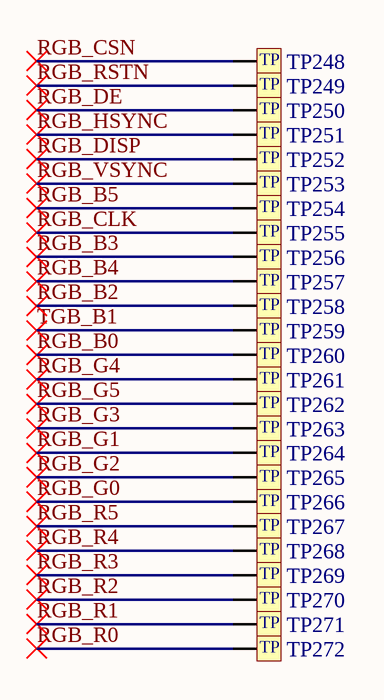
[diagram p7: DISPLAY.SchDoc]

### Parts
TP248  TP_0P8MM  [TP_0P8MM]  (value not drawn)  (no BOM)
TP249  TP_0P8MM  [TP_0P8MM]  (value not drawn)  (no BOM)
TP250  TP_0P8MM  [TP_0P8MM]  (value not drawn)  (no BOM)
TP251  TP_0P8MM  [TP_0P8MM]  (value not drawn)  (no BOM)
TP252  TP_0P8MM  [TP_0P8MM]  (value not drawn)  (no BOM)
TP253  TP_0P8MM  [TP_0P8MM]  (value not drawn)  (no BOM)
TP254  TP_0P8MM  [TP_0P8MM]  (value not drawn)  (no BOM)
TP255  TP_0P8MM  [TP_0P8MM]  (value not drawn)  (no BOM)
TP256  TP_0P8MM  [TP_0P8MM]  (value not drawn)  (no BOM)
TP257  TP_0P8MM  [TP_0P8MM]  (value not drawn)  (no BOM)
TP258  TP_0P8MM  [TP_0P8MM]  (value not drawn)  (no BOM)
TP259  TP_0P8MM  [TP_0P8MM]  (value not drawn)  (no BOM)
TP260  TP_0P8MM  [TP_0P8MM]  (value not drawn)  (no BOM)
TP261  TP_0P8MM  [TP_0P8MM]  (value not drawn)  (no BOM)
TP262  TP_0P8MM  [TP_0P8MM]  (value not drawn)  (no BOM)
TP263  TP_0P8MM  [TP_0P8MM]  (value not drawn)  (no BOM)
TP264  TP_0P8MM  [TP_0P8MM]  (value not drawn)  (no BOM)
TP265  TP_0P8MM  [TP_0P8MM]  (value not drawn)  (no BOM)
TP266  TP_0P8MM  [TP_0P8MM]  (value not drawn)  (no BOM)
TP267  TP_0P8MM  [TP_0P8MM]  (value not drawn)  (no BOM)
TP268  TP_0P8MM  [TP_0P8MM]  (value not drawn)  (no BOM)
TP269  TP_0P8MM  [TP_0P8MM]  (value not drawn)  (no BOM)
TP270  TP_0P8MM  [TP_0P8MM]  (value not drawn)  (no BOM)
TP271  TP_0P8MM  [TP_0P8MM]  (value not drawn)  (no BOM)
TP272  TP_0P8MM  [TP_0P8MM]  (value not drawn)  (no BOM)

### Nets
RGB_B0: TP260.1
RGB_B2: TP258.1
RGB_B3: TP256.1
RGB_B4: TP257.1
RGB_B5: TP254.1
RGB_CLK: TP255.1
RGB_CSN: TP248.1
RGB_DE: TP250.1
RGB_DISP: TP252.1
RGB_G0: TP266.1
RGB_G1: TP264.1
RGB_G2: TP265.1
RGB_G3: TP263.1
RGB_G4: TP261.1
RGB_G5: TP262.1
RGB_HSYNC: TP251.1
RGB_R0: TP272.1
RGB_R1: TP271.1
RGB_R2: TP270.1
RGB_R3: TP269.1
RGB_R4: TP268.1
RGB_R5: TP267.1
RGB_RSTN: TP249.1
RGB_VSYNC: TP253.1
TGB_B1: TP259.1

### Notes on the sheet
- PROJECT
- SIZE
- FILE NAME
- A3
- TITLE
- SHEET
- OF
- REV
- (in symbol TP_0P8MM) TP

### Library data of the parts
TP248-TP272 = TP_0P8MM: OSM Footprint 0P8 LGA Ball

## Sheet PCIE.SchDoc: PCIe Bus
size 420 x 297 mm; Revision: 1.0; SheetNumber: 12
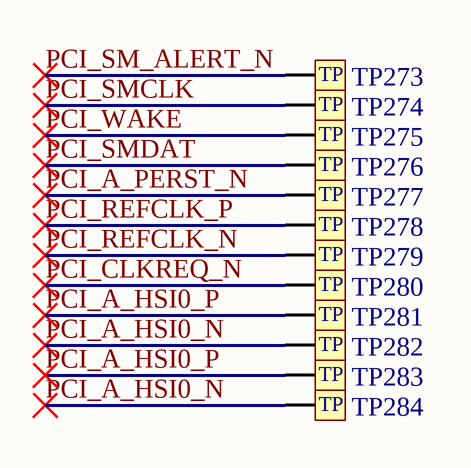
[diagram p8: PCIE.SchDoc]

### Parts
TP273  TP_0P8MM  [TP_0P8MM]  (value not drawn)  (no BOM)
TP274  TP_0P8MM  [TP_0P8MM]  (value not drawn)  (no BOM)
TP275  TP_0P8MM  [TP_0P8MM]  (value not drawn)  (no BOM)
TP276  TP_0P8MM  [TP_0P8MM]  (value not drawn)  (no BOM)
TP277  TP_0P8MM  [TP_0P8MM]  (value not drawn)  (no BOM)
TP278  TP_0P8MM  [TP_0P8MM]  (value not drawn)  (no BOM)
TP279  TP_0P8MM  [TP_0P8MM]  (value not drawn)  (no BOM)
TP280  TP_0P8MM  [TP_0P8MM]  (value not drawn)  (no BOM)
TP281  TP_0P8MM  [TP_0P8MM]  (value not drawn)  (no BOM)
TP282  TP_0P8MM  [TP_0P8MM]  (value not drawn)  (no BOM)
TP283  TP_0P8MM  [TP_0P8MM]  (value not drawn)  (no BOM)
TP284  TP_0P8MM  [TP_0P8MM]  (value not drawn)  (no BOM)

### Nets
PCI_A_HSI0_N: TP282.1 TP284.1
PCI_A_HSI0_P: TP281.1 TP283.1
PCI_A_PERST_N: TP277.1
PCI_CLKREQ_N: TP280.1
PCI_REFCLK_N: TP279.1
PCI_REFCLK_P: TP278.1
PCI_SM_ALERT_N: TP273.1
PCI_SMCLK: TP274.1
PCI_SMDAT: TP276.1
PCI_WAKE: TP275.1

### Notes on the sheet
- PROJECT
- SIZE
- FILE NAME
- A3
- TITLE
- SHEET
- OF
- REV
- (in symbol TP_0P8MM) TP

### Library data of the parts
TP273-TP284 = TP_0P8MM: OSM Footprint 0P8 LGA Ball

## Nets that join several sheets
GND: MCU (18 pins), POWER (58 pins)
RTC_PWR: MCU (C10.1 C11.1 U2.20), POWER (TP18.1)